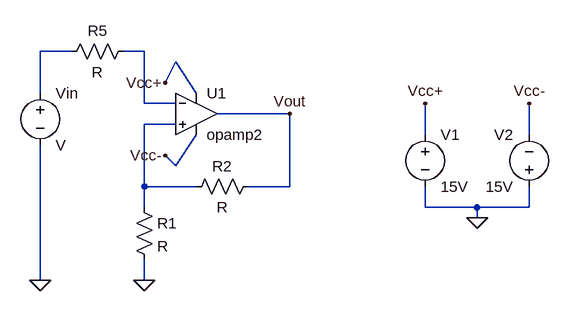
[diagram p0: schematic Draft1.asc]
Draft1.asc, the LTspice schematic file:
Version 4
SHEET 1 880 680
WIRE -272 16 -320 16
WIRE -160 16 -192 16
WIRE -128 64 -112 32
WIRE -320 80 -320 16
WIRE -80 80 -112 32
WIRE -160 96 -160 16
WIRE -112 96 -160 96
WIRE 64 112 -48 112
WIRE -112 128 -160 128
WIRE 272 144 272 96
WIRE 432 144 432 96
WIRE -112 192 -80 144
WIRE -112 192 -128 176
WIRE -160 224 -160 128
WIRE -80 224 -160 224
WIRE 64 224 64 112
WIRE 64 224 0 224
WIRE -160 256 -160 224
WIRE 272 256 272 224
WIRE 352 256 272 256
WIRE 432 256 432 224
WIRE 432 256 352 256
WIRE 352 272 352 256
WIRE -320 368 -320 160
WIRE -160 368 -160 336
FLAG 352 272 0
FLAG 272 96 Vcc+
FLAG 432 96 Vcc-
FLAG -320 368 0
FLAG -128 176 Vcc-
FLAG -128 64 Vcc+
FLAG -160 368 0
FLAG 64 112 Vout
SYMBOL voltage 272 128 R0
WINDOW 123 0 0 Left 2
WINDOW 39 0 0 Left 2
SYMATTR InstName V1
SYMATTR Value 15V
SYMBOL voltage 432 240 R180
WINDOW 0 24 96 Left 2
WINDOW 3 24 16 Left 2
WINDOW 123 0 0 Left 2
WINDOW 39 0 0 Left 2
SYMATTR InstName V2
SYMATTR Value 15V
SYMBOL voltage -320 64 R0
SYMATTR InstName Vin
SYMBOL Opamps\\opamp2 -80 48 R0
SYMATTR InstName U1
SYMBOL res -176 240 R0
SYMATTR InstName R1
SYMBOL res 16 208 R90
WINDOW 0 0 56 VBottom 2
WINDOW 3 32 56 VTop 2
SYMATTR InstName R2
SYMBOL res -176 0 R90
WINDOW 0 0 56 VBottom 2
WINDOW 3 32 56 VTop 2
SYMATTR InstName R5

The netlist it stands for:
* Draft1.asc
V1 Vcc+ 0 15V
V2 0 Vcc- 15V
Vin N001 0 V
XU1 N003 N002 Vcc+ Vcc- Vout opamp2  ; pins In+ In- V+ V- OUT
R1 N003 0 R
R2 Vout N003 R
R5 N002 N001 R
.backanno
.end